# Altium schematic sheet Driver.SchDoc
size A3
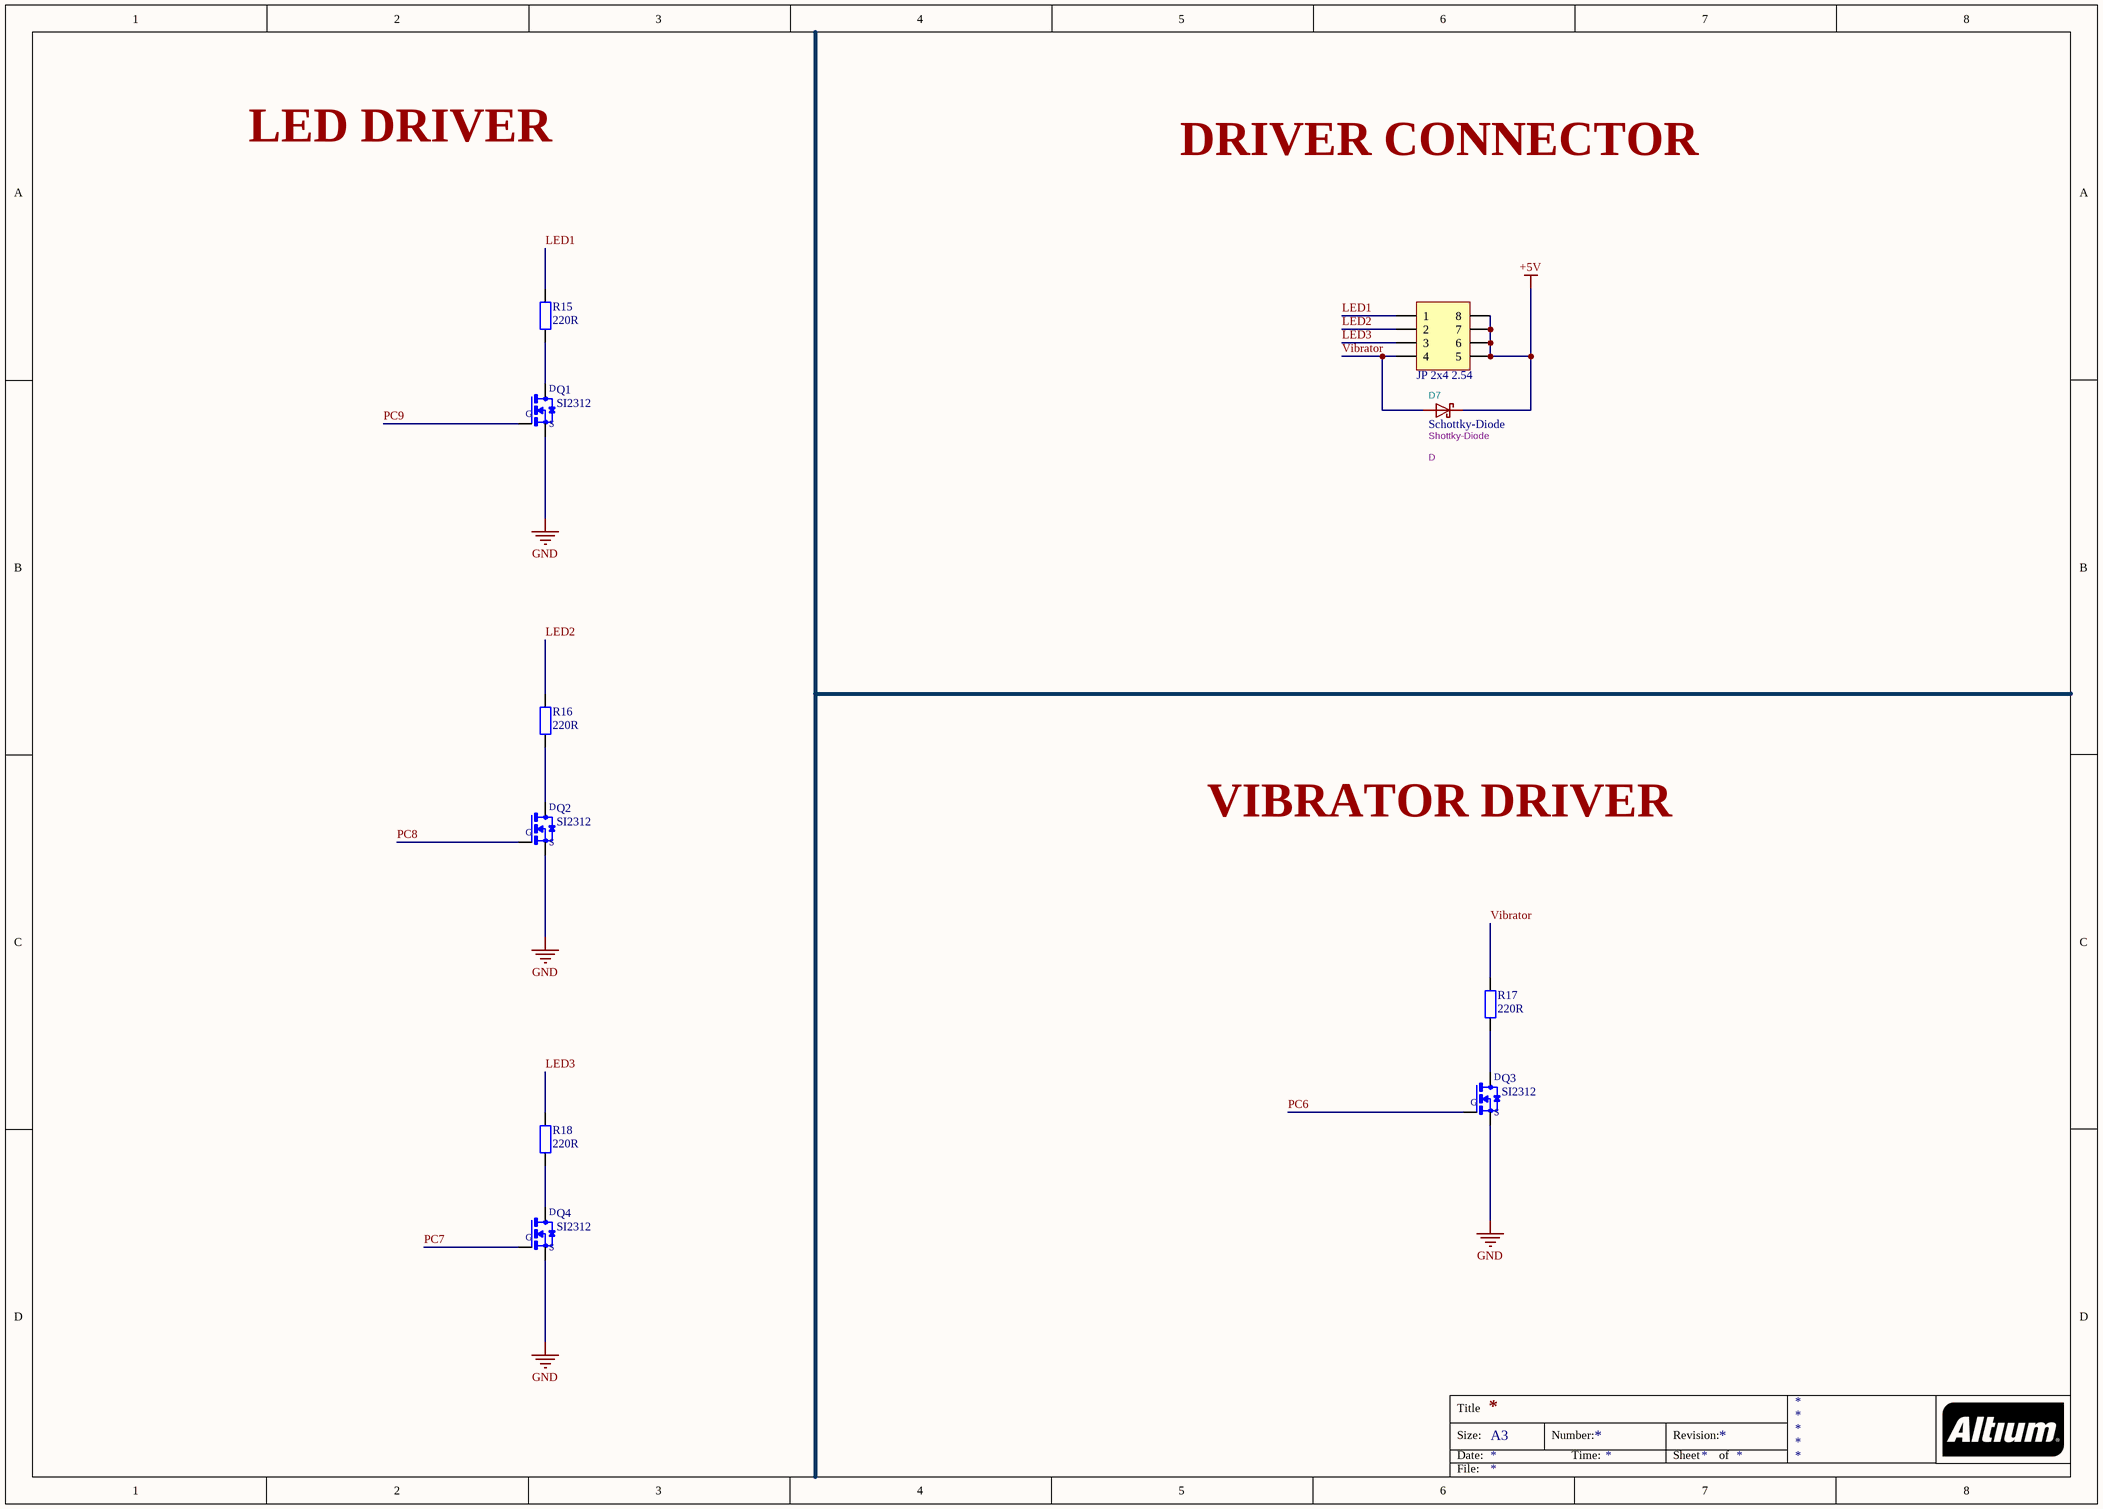
[diagram p0: Driver.SchDoc]

## Parts
D7  Schottky-Diode  value Shottky-Diode  Reference: D  [SOD-80_MiniMELF_Glass]
Driver1  JP 2x4 2.54  [JP 2x4 DT]
Q1  SI2312  [SOT23]
Q2  SI2312  [SOT23]
Q3  SI2312  [SOT23]
Q4  SI2312  [SOT23]
R15  220R  [tro smd 0603]
R16  220R  [tro smd 0603]
R17  220R  [tro smd 0603]
R18  220R  [tro smd 0603]

## Nets
+5V: D7.K Driver1.5 Driver1.6 Driver1.7 Driver1.8
GND: Q1.2(S) Q2.2(S) Q3.2(S) Q4.2(S)
LED1: Driver1.1 R15.2
LED2: Driver1.2 R16.2
LED3: Driver1.3 R18.2
PC6: Q3.1(G)
PC7: Q4.1(G)
PC8: Q2.1(G)
PC9: Q1.1(G)
Vibrator: D7.A Driver1.4 R17.2
NetQ1_3: Q1.3(D) R15.1
NetQ2_3: Q2.3(D) R16.1
NetQ3_3: Q3.3(D) R17.1
NetQ4_3: Q4.3(D) R18.1

## Notes on the sheet
- LED DRIVER
- DRIVER CONNECTOR
- VIBRATOR DRIVER
- Title
- Size:
- Date:
- A3
- Number:
- Time:
- Revision:
- Sheet
- of
- File:

## Library data of the parts
D7 = Schottky-Diode: ki_description: Schottky Diode; Datasheet: https://diotec.com/de/produktliste/SBD.html; ki_keywords: Schottky
Driver1 = JP 2x4 2.54 Duc Thang: Cắm; Ten_Linh_Kien: Jump Đôi Đực 2.54MM 2x40P Thẳng 11MM; Don_Vi: Con; Ma_Hang: MH002686; Ghi_Chu: *; Kieu_Chan: *; Chung_Loai: Cắm
Q1-Q4 = SI2312: <b>N-Channel MOSFET</b>    <a href="https://pricing.snapeda.com/parts/SI2312/Micro%20Commercial%20Components/view-part?ref=eda">Check availability</a> <a href="https://pricing.snapeda.com/parts/SI2312/Micro%20Commercial%20Components/view-part?ref=eda">Check availability</a>; MF: {'manufacturer': u'Micro Commercial Components'}; MP: SI2312-TP; Package: None; Price: None; Value: *; Availability: Unavailable
R15-R18 = Tro 0603 5% 220R: Dán; Don_Vi: Con; So_Chan: 2; Ten_Linh_Kien: Trở 0603 5% 220R; Ma_Hang: MH006322; Chung_Loai: Dán; Kieu_Chan: *